# Altium schematic sheet ARM.SchDoc
size A4; Date: 14.07.2014; DrawnBy: Noah Huetter; SheetNumber: 3; SheetTotal: 3; PageSetup: Record=PageOptions|CenterHorizontal=True|CenterVertical=True|PrintScale=1.00|XCorrection=1.00|YCorrection=1.00|PrintKind=0|BorderSize=5000000|LeftOffset=0|BottomOffset=0|Orientation=2|PaperLength=1000|PaperWidth=1000|Scale=100|PaperSource=7|PrintQuality=-3|MediaType=1|DitherType=10|PrintScaleMode=1|PaperKind=A4|PaperIndex=9; DocumentName: STM32F3 PLUGALL
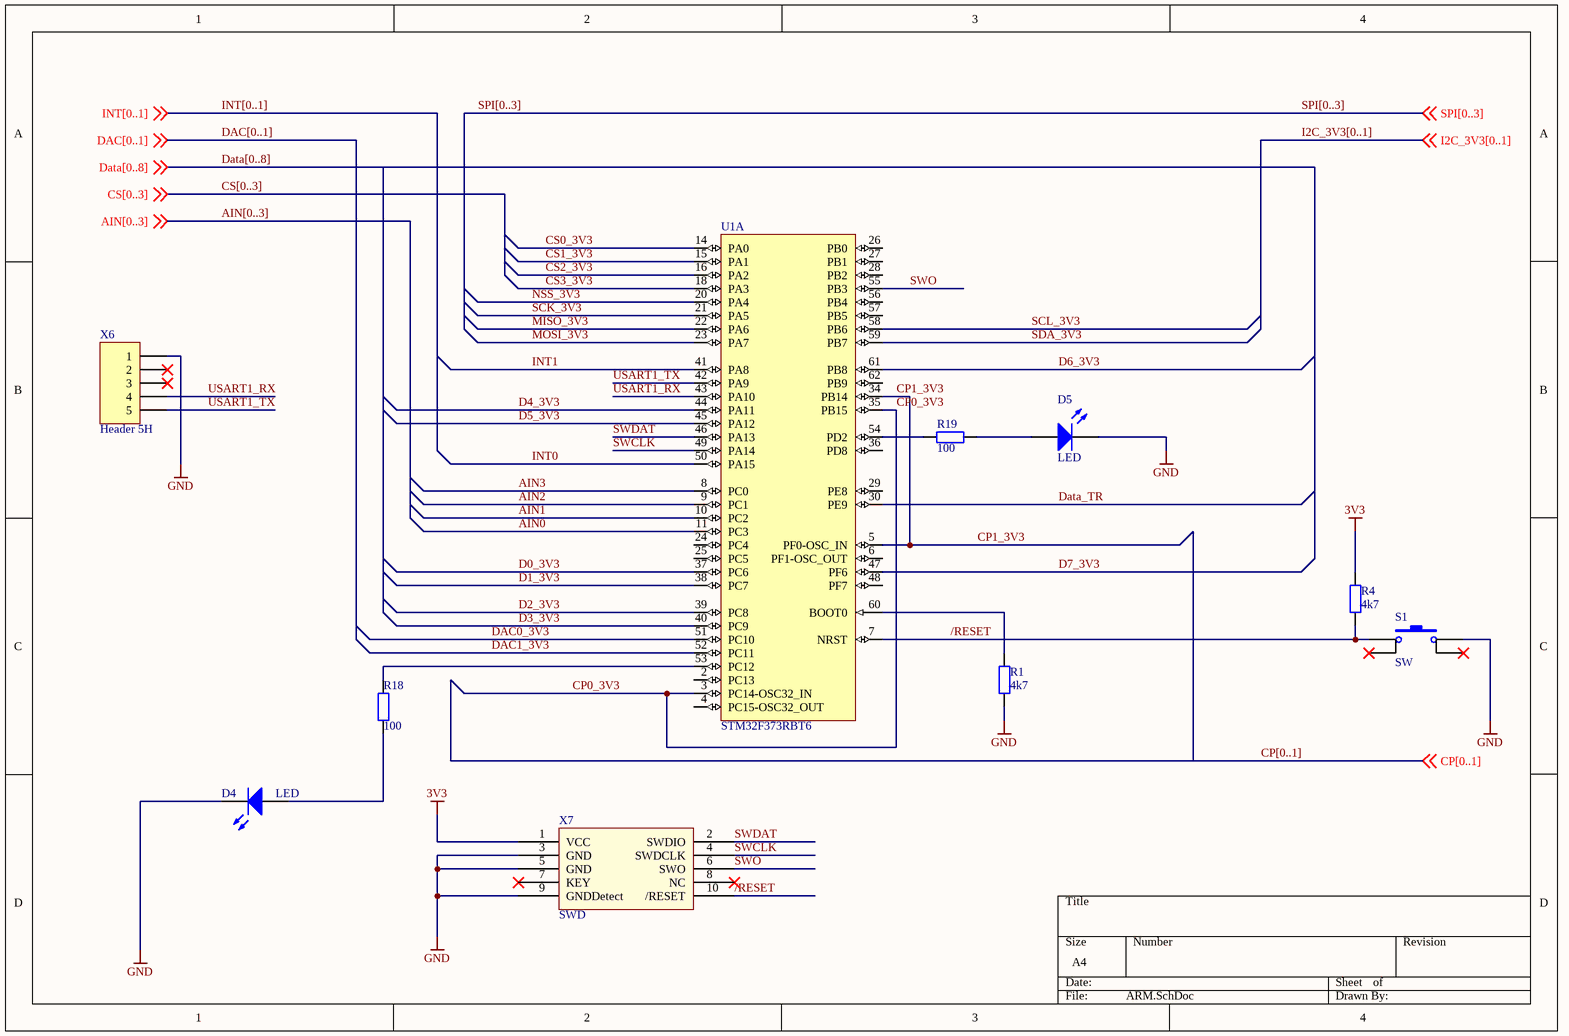
[diagram p0: ARM.SchDoc]

## Parts
D4  LED  [D_0603]
D5  LED  [D_0603]
R1  value 4k7  [R_0603]  (hidden comment: R)
R4  value 4k7  [R_0603]  (hidden comment: R)
R18  value 100  [R_0603]  (hidden comment: R)
R19  value 100  [R_0603]  (hidden comment: R)
S1  SW  [SW_4x4x1.5]
U1  STM32F373RBT6  [STM-LQFP64_V]  (part A of 2)
X6  Header 5H  [HDR1X5H]
X7  SWD  [4448.0054]

## Nets
3V3: R4.2 X7.1(VCC)
GND: D4.2(K) D5.2(K) R1.1 S1.2 X6.1 X7.3(GND) X7.5(GND) X7.9(GNDDetect)
/RESET: R4.1 S1.1 U1.7(NRST) X7.10(/RESET)
AIN0: U1.11(PC3)
AIN1: U1.10(PC2)
AIN2: U1.9(PC1)
AIN3: U1.8(PC0)
CP0_3V3: U1.3(PC14-OSC32_IN) U1.35(PB15)
CP1_3V3: U1.5(PF0-OSC_IN) U1.34(PB14)
CS0_3V3: U1.14(PA0)
CS1_3V3: U1.15(PA1)
CS2_3V3: U1.16(PA2)
CS3_3V3: U1.18(PA3)
D0_3V3: U1.37(PC6)
D1_3V3: U1.38(PC7)
D2_3V3: U1.39(PC8)
D3_3V3: U1.40(PC9)
D4_3V3: U1.44(PA11)
D5_3V3: U1.45(PA12)
D6_3V3: U1.61(PB8)
D7_3V3: U1.47(PF6)
DAC0_3V3: U1.51(PC10)
DAC1_3V3: U1.52(PC11)
Data_TR: U1.30(PE9)
INT0: U1.50(PA15)
INT1: U1.41(PA8)
MISO_3V3: U1.22(PA6)
MOSI_3V3: U1.23(PA7)
NSS_3V3: U1.20(PA4)
SCK_3V3: U1.21(PA5)
SCL_3V3: U1.58(PB6)
SDA_3V3: U1.59(PB7)
SWCLK: U1.49(PA14) X7.4(SWDCLK)
SWDAT: U1.46(PA13) X7.2(SWDIO)
SWO: U1.55(PB3) X7.6(SWO)
USART1_RX: U1.43(PA10) X6.4
USART1_TX: U1.42(PA9) X6.5
NetD4_1: D4.1(A) R18.1
NetD5_1: D5.1(A) R19.1
NetR1_2: R1.2 U1.60(BOOT0)
NetR18_2: R18.2 U1.53(PC12)
NetR19_2: R19.2 U1.54(PD2)

Not connected (* = marked no-connect by the designer): S1 3* 4*; U1 2(PC13) 4(PC15-OSC32_OUT) 6(PF1-OSC_OUT) 24(PC4) 25(PC5) 26(PB0) 27(PB1) 28(PB2) 29(PE8) 36(PD8) 48(PF7) 56(PB4) 57(PB5) 62(PB9); X6 2* 3*; X7 7(KEY)* 8(NC)*

## Buses and harness runs
bus AIN[0..3]
bus CP[0..1]
bus CS[0..3]
bus DAC[0..1]
bus Data[0..8]
bus I2C_3V3[0..1]
bus INT[0..1]
bus SPI[0..3]

## Library data of the parts
D4 = LED: Value: GRN
D5 = LED: Value: RED
R1 R4 R18 R19 = RES_EU
U1 = CMP-0572-00032-2: ARM Cortex-M4 32-bit MCU, 128 KB Flash, 24 KB Internal RAM, 52 I/Os, 64-pin LQFP, -40 to 85 degC, Tray; FLASH Size (Prog) (kB): 128; Operating Frequency(F) (Processor speed) (MHz): 72; Supply Voltage(Vcc) min (V): 2; Internal RAM Size (kB): 24; I/Os (High Current): 52; Value: STM32F372RBT6; PackageVersion: Rev. 4, 06/2013; Core: ARM Cortex-M4; Packing: Tray; ComponentLink2URL: http://www.st.com/st-web-ui/static/active/en/resource/technical/document/datasheet/DM00046749.pdf; PackageReference: LQFP64; PartNumber: STM32F373RBT6; ComponentLink1URL: http://www.st.com/web/en/home.html; ComponentLink1Description: Manufacturer URL; PackageDescription: 64-Pin Low Profile Quad Flat Package, 10 x 10 mm Body, 0.5 mm Pitch; DatasheetVersion: Rev. 3; ComponentLink3Description: Package Specification; ComponentLink2Description: Datasheet; Mounting Technology: Surface Mount; ComponentLink3URL: http://www.st.com/st-web-ui/static/active/en/resource/technical/document/datasheet/DM00037051.pdf
X6 = Header 5H: Header, 5-Pin, Right Angle; Value: 1X5; LatestRevisionDate: 17-Jul-2002; LatestRevisionNote: Re-released for DXP Platform.; Publisher: Altium Limited
X7 = SWD: Value: 2X5
S1 = SW: Value: SW